# EAGLE design multidac (EAGLE 6.6.0)
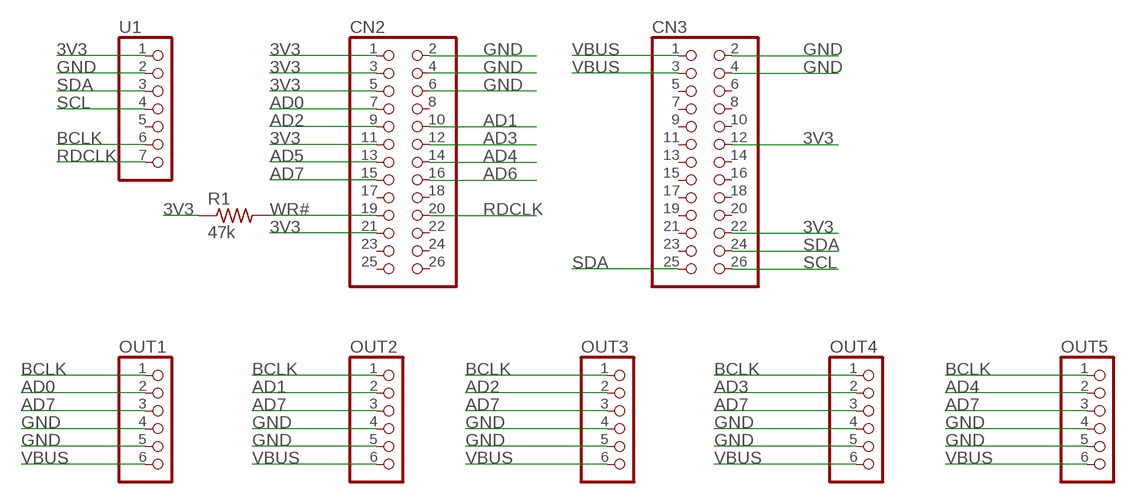
[diagram p0: schematic, sheet 1]

## Parts
CN2  PINHD-2X13  [2X13]
CN3  PINHD-2X13  [2X13]
OUT1  PINHD-1X6  [1X06]
OUT2  PINHD-1X6  [1X06]
OUT3  PINHD-1X6  [1X06]
OUT4  PINHD-1X6  [1X06]
OUT5  PINHD-1X6  [1X06]
R1  47k  R-US_R1206  [R1206]
U1  PINHD-1X7  [1X07]

## Nets
3V3: CN2.1 CN2.3 CN2.5 CN2.11 CN2.21 CN3.12 CN3.22 R1.1 U1.1
AD0: CN2.7 OUT1.2
AD1: CN2.10 OUT2.2
AD2: CN2.9 OUT3.2
AD3: CN2.12 OUT4.2
AD4: CN2.14 OUT5.2
AD5: CN2.13
AD6: CN2.16
AD7: CN2.15 OUT1.3 OUT2.3 OUT3.3 OUT4.3 OUT5.3
BCLK: OUT1.1 OUT2.1 OUT3.1 OUT4.1 OUT5.1 U1.6
GND: CN2.2 CN3.2 CN3.4 OUT1.4 OUT1.5 OUT2.4 OUT2.5 OUT3.4 OUT3.5 OUT4.4 OUT4.5 OUT5.4 OUT5.5 U1.2
RDCLK: CN2.20 U1.7
SCL: CN3.26 U1.4
SDA: CN3.24 CN3.25 U1.3
VBUS: CN3.1 CN3.3 OUT1.6 OUT2.6 OUT3.6 OUT4.6 OUT5.6
WR#: CN2.19 R1.2
Unconnected: CN2.4 CN2.6 CN2.8 CN2.17 CN2.18 CN2.22 CN2.23 CN2.24 CN2.25 CN2.26 CN3.5 CN3.6 CN3.7 CN3.8 CN3.9 CN3.10 CN3.11 CN3.13 CN3.14 CN3.15 CN3.16 CN3.17 CN3.18 CN3.19 CN3.20 CN3.21 CN3.23 U1.5

## Library data of the parts
CN2 CN3 = pinhead:PINHD-2X13: PIN HEADER
OUT1-OUT5 = pinhead:PINHD-1X6: PIN HEADER
R1 = resistor:R-US_: RESISTOR, American symbol
U1 = pinhead:PINHD-1X7: PIN HEADER

## Board
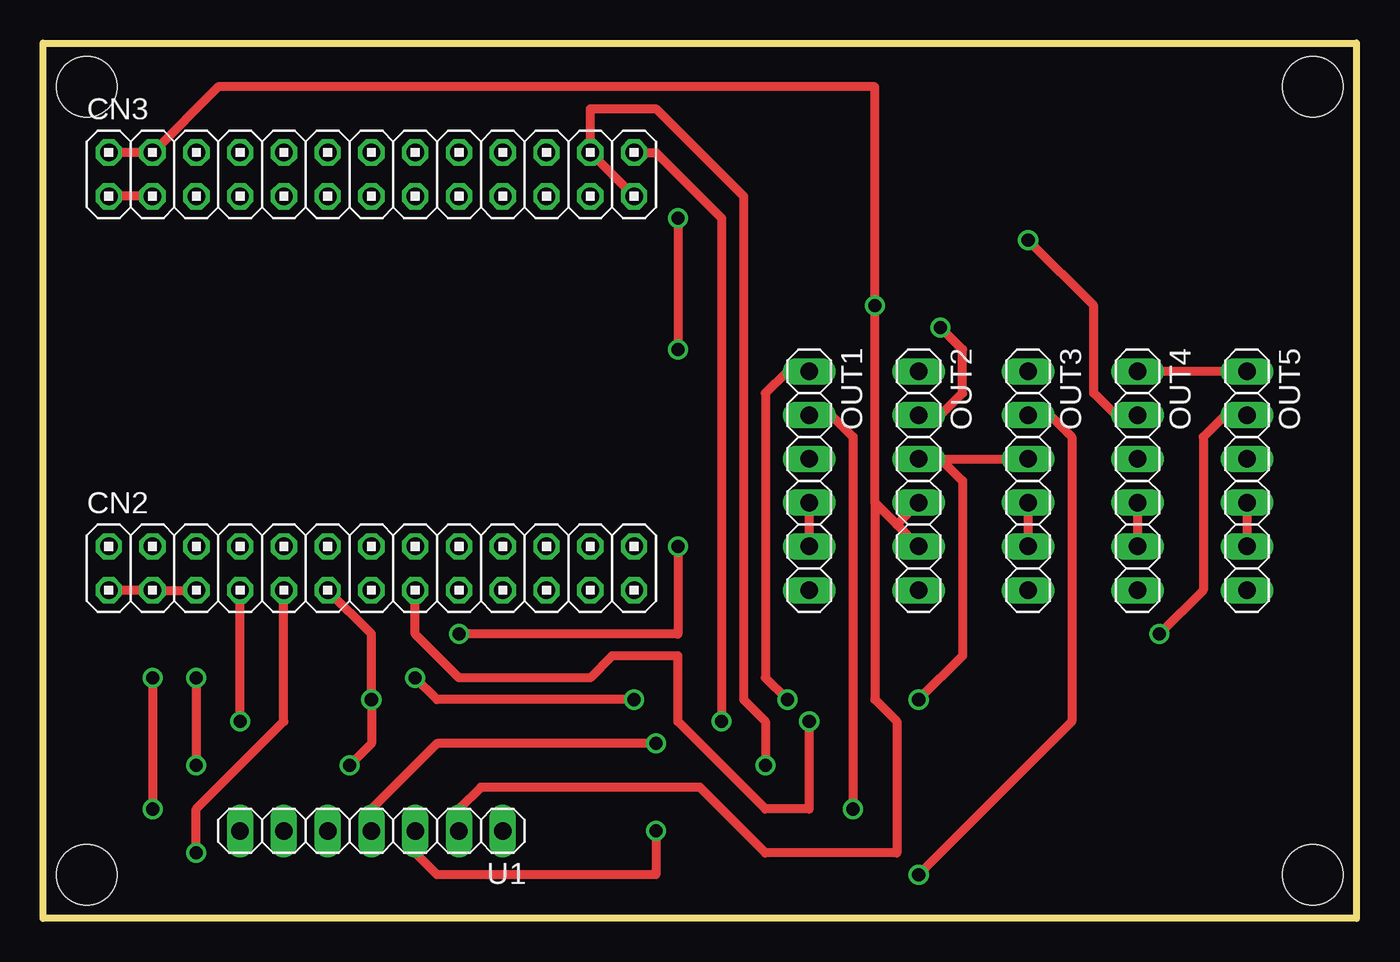
[diagram p1: board, top side]
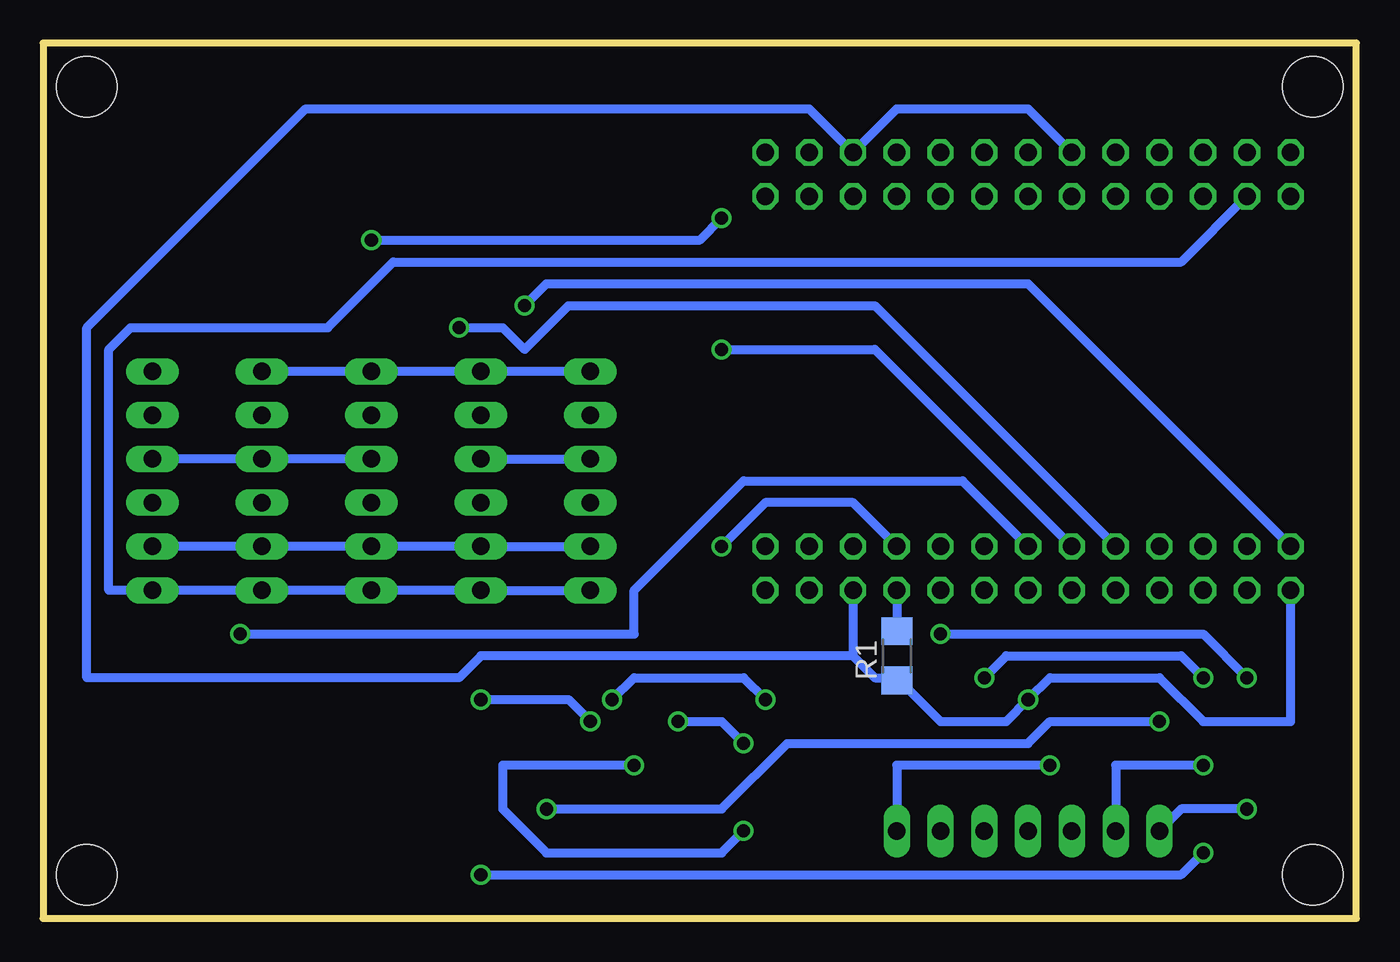
[diagram p2: board, bottom side, seen from below]

Size 76.2 x 50.8 mm. Coordinates in mm from the lower left corner, seen from the top.
Outline: 0,0 0,50.8 76.2,50.8 76.2,0 0,0
Copper layers (1*16): Top 0.035mm / dielectric 1.5mm / Bottom 0.035mm
Design rules "default *": minimum track width 20mil, minimum drill 30mil, track to track 20mil, track to pad 20mil, pad to pad 20mil, via to via 20mil, smd to smd 20mil, copper to edge 40mil, drill to drill 20mil, minimum pad ring 10mil, minimum via ring 8mil, stop-mask expansion 4mil, vias tented up to drill 0mil, thermal gap 10mil
Holes 3.5 mm at 2.54,2.54 2.54,48.26 73.66,48.26 73.66,2.54
tRestrict: area 2.5,22.9 to 35.6,40.6

### Footprints (pad centres in the part's own frame; a part is rotated, then mirrored left to right if it is on the bottom)
2X13 = drill 1.016 octagon: 1 -15.24,-1.27; 2 -15.24,1.27; 3 -12.7,-1.27; 4 -12.7,1.27; 5 -10.16,-1.27; 6 -10.16,1.27; 7 -7.62,-1.27; 8 -7.62,1.27; 9 -5.08,-1.27; 10 -5.08,1.27; 11 -2.54,-1.27; 12 -2.54,1.27; 13 0,-1.27; 14 0,1.27; 15 2.54,-1.27; 16 2.54,1.27; 17 5.08,-1.27; 18 5.08,1.27; 19 7.62,-1.27; 20 7.62,1.27; 21 10.16,-1.27; 22 10.16,1.27; 23 12.7,-1.27; 24 12.7,1.27; 25 15.24,-1.27; 26 15.24,1.27
1X06 = drill 1.016 long: 1 -6.35,0; 2 -3.81,0; 3 -1.27,0; 4 1.27,0; 5 3.81,0; 6 6.35,0
R1206 = smd 1.6 x 1.803: 1 -1.422,0; 2 1.422,0
1X07 = drill 1.016 long: 1 -7.62,0; 2 -5.08,0; 3 -2.54,0; 4 0,0; 5 2.54,0; 6 5.08,0; 7 7.62,0

### Placement (x,y rotation side)
CN2  19.05,20.32 0 top
CN3  19.05,43.18 0 top
OUT1  44.45,25.4 270 top
OUT2  50.8,25.4 270 top
OUT3  57.15,25.4 270 top
OUT4  63.5,25.4 270 top
OUT5  69.85,25.4 270 top
R1  26.67,15.24 90 bottom
U1  19.05,5.08 180 top

### Tracks (layer width: path | path; a pad name or v marks a point on that pad's centre or on a via)
3V3  (via drill 0.76)
  Top 0.508: CN2.1 CN2.3 CN2.5 | CN2.11 19.05,16.51 v19.05,12.7 19.05,10.16 v17.78,8.89
  Bottom 0.508: CN3.12 19.05,46.99 26.67,46.99 CN3.22 31.75,46.99 60.96,46.99 73.66,34.29 73.66,13.97 52.07,13.97 50.8,15.24 29.21,15.24 | 26.67,13.97 27.94,13.97 29.21,15.24 | CN2.21 29.21,15.24 | 26.67,13.97 24.13,11.43 20.32,11.43 v19.05,12.7 17.78,13.97 11.43,13.97 8.89,11.43 3.81,11.43 CN2.1 | 26.67,13.97 R1.1 | U1.1 26.67,8.89 v17.78,8.89
AD0  (via drill 0.76)
  Top 0.508: v11.43,11.43 CN2.7 | v46.99,6.35 46.99,27.94 45.72,29.21 OUT1.2
  Bottom 0.508: v11.43,11.43 17.78,11.43 19.05,10.16 33.02,10.16 36.83,6.35 v46.99,6.35
AD1  (via drill 0.76)
  Top 0.508: v52.07,34.29 53.34,33.02 53.34,30.48 52.07,29.21 OUT2.2
  Bottom 0.508: CN2.10 27.94,35.56 45.72,35.56 48.26,33.02 49.53,34.29 v52.07,34.29
AD2  (via drill 0.76)
  Top 0.508: CN2.9 13.97,11.43 8.89,6.35 v8.89,3.81 | v50.8,2.54 59.69,11.43 59.69,27.94 58.42,29.21 OUT3.2
  Bottom 0.508: v8.89,3.81 10.16,2.54 v50.8,2.54
AD3  (via drill 0.76)
  Top 0.508: v36.83,40.64 v36.83,33.02 | v57.15,39.37 60.96,35.56 60.96,30.48 62.23,29.21 OUT4.2
  Bottom 0.508: CN2.12 27.94,33.02 v36.83,33.02 | v36.83,40.64 38.1,39.37 v57.15,39.37
AD4  (via drill 0.76)
  Top 0.508: v64.77,16.51 67.31,19.05 67.31,27.94 68.58,29.21 OUT5.2
  Bottom 0.508: CN2.14 22.86,25.4 35.56,25.4 41.91,19.05 41.91,16.51 v64.77,16.51
AD7  (via drill 0.76)
  Top 0.508: CN2.15 21.59,16.51 24.13,13.97 31.75,13.97 33.02,15.24 36.83,15.24 36.83,11.43 41.91,6.35 44.45,6.35 v44.45,11.43 | v50.8,12.7 53.34,15.24 53.34,25.4 52.07,26.67 | 52.07,26.67 OUT3.3 | 52.07,26.67 OUT2.3
  Bottom 0.508: v44.45,11.43 45.72,12.7 v50.8,12.7 | OUT2.3 OUT1.3 | OUT3.3 OUT4.3 OUT5.3
BCLK  (via drill 0.76)
  Top 0.508: OUT5.1 OUT4.1 | v8.89,13.97 v8.89,8.89 | v21.59,13.97 22.86,12.7 v34.29,12.7 | v43.18,12.7 41.91,13.97 41.91,30.48 43.18,31.75 OUT1.1
  Bottom 0.508: U1.6 13.97,8.89 v8.89,8.89 | v8.89,13.97 10.16,15.24 20.32,15.24 v21.59,13.97 | v34.29,12.7 35.56,13.97 41.91,13.97 v43.18,12.7 | OUT1.1 OUT2.1 OUT3.1 OUT4.1
GND  (via drill 0.76)
  Top 0.508: CN3.2 CN3.4 10.16,48.26 48.26,48.26 v48.26,35.56 48.26,24.13 | OUT5.4 OUT5.5 | OUT4.4 OUT4.5 | OUT3.4 OUT3.5 | OUT1.4 OUT1.5 | OUT2.5 49.53,22.86 | 49.53,22.86 48.26,24.13 | U1.2 24.13,6.35 25.4,7.62 38.1,7.62 41.91,3.81 49.53,3.81 49.53,11.43 48.26,12.7 48.26,24.13 | 49.53,22.86 OUT2.4
  Bottom 0.508: CN2.2 19.05,36.83 46.99,36.83 v48.26,35.56 | OUT1.5 OUT2.5 OUT3.5 OUT4.5 OUT5.5
RDCLK  (via drill 0.76)
  Top 0.508: v6.35,13.97 v6.35,6.35 | v24.13,16.51 36.83,16.51 v36.83,21.59
  Bottom 0.508: U1.7 10.16,6.35 v6.35,6.35 | v6.35,13.97 8.89,16.51 v24.13,16.51 | v36.83,21.59 34.29,24.13 29.21,24.13 CN2.20
SCL  (via drill 0.76)
  Top 0.508: U1.4 19.05,6.35 22.86,10.16 v35.56,10.16 | v39.37,11.43 39.37,40.64 35.56,44.45 CN3.26
  Bottom 0.508: v35.56,10.16 36.83,11.43 v39.37,11.43
SDA  (via drill 0.76)
  Top 0.508: U1.3 21.59,3.81 22.86,2.54 35.56,2.54 v35.56,5.08 | v41.91,8.89 41.91,11.43 40.64,12.7 40.64,41.91 35.56,46.99 31.75,46.99 CN3.24 CN3.25
  Bottom 0.508: v35.56,5.08 36.83,3.81 46.99,3.81 49.53,6.35 49.53,8.89 v41.91,8.89
VBUS
  Top 0.508: CN3.3 CN3.1
  Bottom 0.508: OUT1.6 OUT2.6 OUT3.6 OUT4.6 OUT5.6 72.39,19.05 72.39,33.02 71.12,34.29 59.69,34.29 55.88,38.1 10.16,38.1 CN3.3
WR#
  Bottom 0.508: CN2.19 R1.2 26.67,16.51